# Altium schematic sheet Signal.SchDoc
size A4
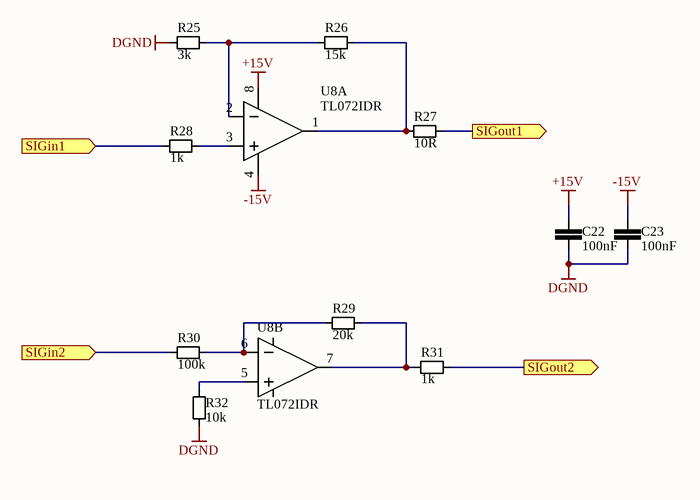
[diagram p0: Signal.SchDoc]

## Parts
C22  value 100nF  [0603-C]  (hidden comment: Cap)
C23  value 100nF  [0603-C]  (hidden comment: Cap)
R25  value 3k  [0603-R]  (hidden comment: Res)
R26  value 15k  [0603-R]  (hidden comment: Res)
R27  value 10R  [0603-R]  (hidden comment: Res)
R28  value 1k  [0603-R]  (hidden comment: Res)
R29  value 20k  [0603-R]  (hidden comment: Res)
R30  value 100k  [0603-R]  (hidden comment: Res)
R31  value 1k  [0603-R]  (hidden comment: Res)
R32  value 10k  [0603-R]  (hidden comment: Res)
U8  TL072IDR  [SO-8_N]  (parts A,B of 2)

## Ports
SIGin1 (in), SIGin2 (in), SIGout1 (out), SIGout2 (out)

## Nets
+15V: C22.1 U8.8
-15V: C23.1 U8.4
DGND: C22.2 C23.2 R25.2 R32.1
SIGin1: R28.1 ; port SIGin1
SIGin2: R30.2 ; port SIGin2
SIGout1: R27.2 ; port SIGout1
SIGout2: R31.2 ; port SIGout2
NetR25_1: R25.1 R26.1 U8.2
NetR26_2: R26.2 R27.1 U8.1
NetR28_2: R28.2 U8.3
NetR29_1: R29.1 R31.1 U8.7
NetR29_2: R29.2 R30.1 U8.6
NetR32_2: R32.2 U8.5

## Library data of the parts
C22 C23 = C21C100NK1H0: MLCC 100nF 10% 50V X7R 0603; TemperatureRange: -55°C to 150°C; VenderID: MLCC-0603-50V-104K-X7R; Published: 1-Jun-2017; Publisher: GreenBox; MountType: SMT; PackageReference: 0603; Manufacturer: *
R25 = R11C003KFBF0: SMD Resistor 3k 1% 1/10W 0603 100PPM; TemperatureRange: -55°C to 150°C; VenderID: RES-0603-3k-1%; Published: 1-Jun-2017; Publisher: GreenBox; MountType: SMT; PackageReference: 0603; Manufacturer: *
R26 = R11C015KFBF0: SMD Resistor 15k 1% 1/10W 0603 100PPM; TemperatureRange: -55°C to 150°C; VenderID: RES-0603-15k-1%; Published: 1-Jun-2017; Publisher: GreenBox; MountType: SMT; PackageReference: 0603; Manufacturer: *
R27 = R11C010RFBF0: SMD Resistor 10R 1% 1/10W 0603 100PPM; TemperatureRange: -55°C to 150°C; VenderID: RES-0603-10R-1%; Published: 1-Jun-2017; Publisher: GreenBox; MountType: SMT; PackageReference: 0603; Manufacturer: *
R28 R31 = R11C001KFBF0: SMD Resistor 1k 1% 1/10W 0603 100PPM; TemperatureRange: -55°C to 150°C; VenderID: RES-0603-1k-1%; Published: 1-Jun-2017; Publisher: GreenBox; MountType: SMT; PackageReference: 0603; Manufacturer: *
R29 = R11C020KFBF0: SMD Resistor 20k 1% 1/10W 0603 100PPM; TemperatureRange: -55°C to 150°C; VenderID: RES-0603-20k-1%; Published: 1-Jun-2017; Publisher: GreenBox; MountType: SMT; PackageReference: 0603; Manufacturer: *
R30 = R11C100KFBF0: SMD Resistor 100k 1% 1/10W 0603 100PPM; TemperatureRange: -55°C to 150°C; VenderID: RES-0603-100k-1%; Published: 1-Jun-2017; Publisher: GreenBox; MountType: SMT; PackageReference: 0603; Manufacturer: *
R32 = R11C010KFBF0: SMD Resistor 10k 1% 1/10W 0603 100PPM; TemperatureRange: -55°C to 150°C; VenderID: RES-0603-10k-1%; Published: 1-Jun-2017; Publisher: GreenBox; MountType: SMT; PackageReference: 0603; Manufacturer: *
U8 = UOS1TLC072IT: Dual Operational Amplifier TL072IDR Vcc ±18V Vio 3mV; Manufacturer: TEXAS INSTRUMENTS; TemperatureRange: -40°C to 85°C; Publisher: GreenBox; Published: 1-Jan-2016; PackageReference: SOIC(8); MountType: SMT; VenderID: TL072IDR; PackageDescription: 8-Pin Small Outline Integrated Circuit 1.27 mm Pitch